# Altium schematic sheet SDCARD.SchDoc: SD CARD NO BOOT
size A4; DrawnBy: ThanhQuoc; Revision: V01; SheetNumber: 12; SheetTotal: 21; Project: RV1126 CAMERA BOARD DESIGN
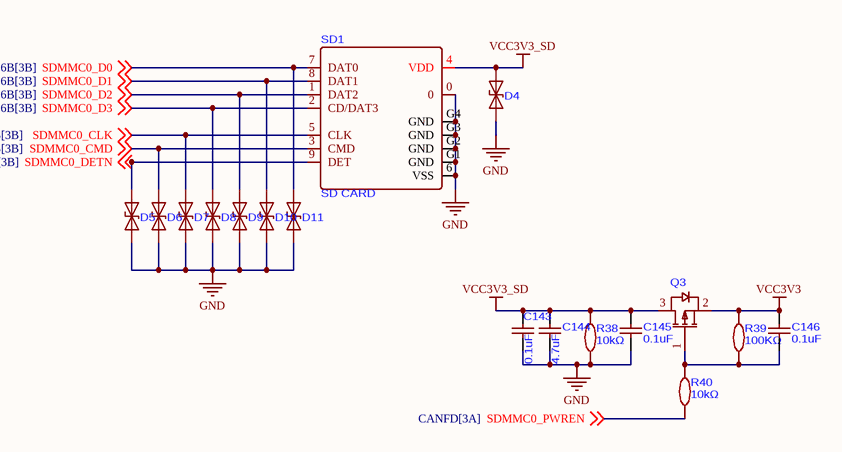
[diagram p0: SDCARD.SchDoc]

## Parts
C143  0.1uF  [C0201]
C144  4.7uF  [C0402]
C145  0.1uF  [C0201]
C146  0.1uF  [C0201]
D4  ESD DIODE  [DSN0603-2_L0.7-W0.3-P0.40-BI]  (value not drawn)
D5  ESD DIODE  [DSN0603-2_L0.7-W0.3-P0.40-BI]  (value not drawn)
D6  ESD DIODE  [DSN0603-2_L0.7-W0.3-P0.40-BI]  (value not drawn)
D7  ESD DIODE  [DSN0603-2_L0.7-W0.3-P0.40-BI]  (value not drawn)
D8  ESD DIODE  [DSN0603-2_L0.7-W0.3-P0.40-BI]  (value not drawn)
D9  ESD DIODE  [DSN0603-2_L0.7-W0.3-P0.40-BI]  (value not drawn)
D10  ESD DIODE  [DSN0603-2_L0.7-W0.3-P0.40-BI]  (value not drawn)
D11  ESD DIODE  [DSN0603-2_L0.7-W0.3-P0.40-BI]  (value not drawn)
Q3  P-CHANNEL  [SOT-23-3_L2.9-W1.3-P1.90-LS2.4-BR]  (value not drawn)
R38  10kΩ  [R0201]
R39  100KΩ  [R0201]
R40  10kΩ  [R0201]
SD1  SD CARD  [CONN-SMD_1051620101]

## Nets
GND: C143.1 C144.1 C145.1 D4.1(K) D5.1(K) D6.1(K) D7.1(K) D8.1(K) D9.1(K) D10.1(K) D11.1(K) R38.1 SD1.0 SD1.6(VSS) SD1.G1(GND) SD1.G2(GND) SD1.G3(GND) SD1.G4(GND)
VCC3V3: C146.2 Q3.2(S) R39.2
VCC3V3_SD: C143.2 C144.2 C145.2 D4.2(A) Q3.3(D) R38.2 SD1.4(VDD)
SDMMC0_CLK: D7.2(A) SD1.5(CLK) ; off-sheet SDMMC0_CLK
SDMMC0_CMD: D6.2(A) SD1.3(CMD) ; off-sheet SDMMC0_CMD
SDMMC0_D0: D11.2(A) SD1.7(DAT0) ; off-sheet SDMMC0_D0
SDMMC0_D1: D10.2(A) SD1.8(DAT1) ; off-sheet SDMMC0_D1
SDMMC0_D2: D9.2(A) SD1.1(DAT2) ; off-sheet SDMMC0_D2
SDMMC0_D3: D8.2(A) SD1.2(CD/DAT3) ; off-sheet SDMMC0_D3
SDMMC0_DETN: D5.2(A) SD1.9(DET) ; off-sheet SDMMC0_DETN
SDMMC0_PWREN: R40.1 ; off-sheet SDMMC0_PWREN
NetC146_1: C146.1 Q3.1(G) R39.1 R40.2

## Notes on the sheet
- Title:
- Drawn By:
- Page Contents:
- Checked By:
- Size:
- Date:
- File:
- License:
- Email:
- A4
- nguyenthanhquoc0206@gmail.com
- Number:
- Time:
- Revision:
- Sheet
- Website:
- of
- https://www.facebook.com/ntq.687

## Library data of the parts
C143 C145 C146 = CAP_100nF-6.3V-10%-0201_1: 0.1uF ±10% 6.3V Ceramic Capacitor X5R 0201
C144 = CAP_4.7uF-16V-10%-0402: 4.7uF ±10% 16V Ceramic Capacitor X5R 0402
D4-D11 = PESD5V0H1BSFYL: ESD DIODE 5VWM 5VC DSN0603-2 0.13PF
Q3 = WPM3407-3/TR: MOSFET P-CH 30V 4.4A SOT-23
R38 R40 = RES_10K-50mW-1%-0201: RES 10KΩ ±1% 50mW 0201; ComponentLink1Description: LCSC; ComponentLink1URL: https://www.lcsc.com/product-detail/C93949.html?spm=wm.fly.bg.0.xh&lcsc_vid=EwRWBFZSQVIPVFdUTlJfVldeFFRYUFQAElRYBFRRE1MxVlNeRVlXUFNQQ1RWXjsOAxUeFF5JWBYZEEoKFBINSQcJGk4eFQsCAgIaSgADAwAHC0slRlVYUFFIHxUDCw%3D%3D
R39 = RES_100K-50mW-1%-0201: RES 100kΩ ±1% 50mW 0201; ComponentLink1Description: LCSC; ComponentLink1URL: https://www.lcsc.com/product-detail/C295718.html?s_z=n_q_t_120%2520OHM&spm=wm.fly.bg.5.xh___wm.ssy.tc.1.tz&lcsc_vid=EwRWBFZSQVIPVFdUTlJfVldeFFRYUFQAElRYBFRRE1MxVlNeRFZeU1BfTlBYVzsOAxUeFF5JWBYZEEoKFBINSQcJGk4eFQsCAgIaSgADAwAHC0slRVhcV1ZTT08GEwkK
SD1 = 1051620001: CONN MICRO SD CARD (TF CARD)